# EAGLE design untitled (EAGLE 7.4.0)
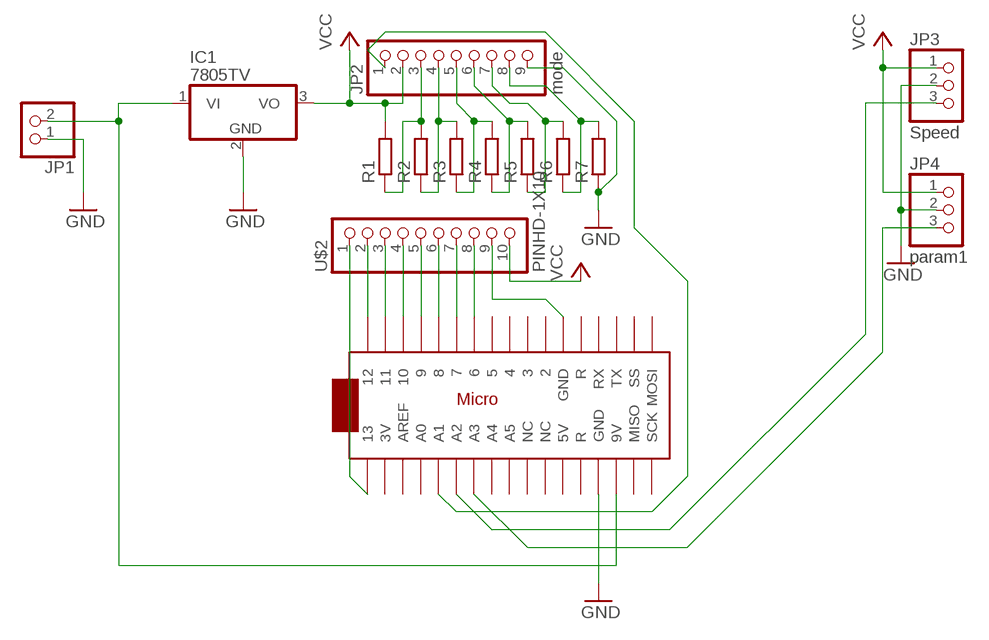
[diagram p0: schematic, sheet 1]

## Parts
IC1  7805TV  [TO220V]
JP1  PINHD-1X2  [1X02]
JP2  mode  PINHD-1X9  [1X09-BIG]
JP3  Speed  PINHD-1X3  [1X03]
JP4  param1  PINHD-1X3  [1X03]
R1  R-EU_0204/7  [0204/7]
R2  R-EU_0204/7  [0204/7]
R3  R-EU_0204/7  [0204/7]
R4  R-EU_0204/7  [0204/7]
R5  R-EU_0204/7  [0204/7]
R6  R-EU_0204/7  [0204/7]
R7  R-EU_0204/7  [0204/7]
U$1  ARDUINOMICRO  [ARDUINOMICRO]
U$2  PINHD-1X10  [1X10-BIG]

## Nets
GND: IC1.2(GND) JP1.1 JP2.9 JP3.2 JP4.2 R7.1 U$1.P$12(GND)
N$1: IC1.1(VI) JP1.2 U$1.P$20(9V)
N$3: JP2.3 R1.1 R2.2
N$4: JP2.4 R2.1 R3.2
N$5: JP2.5 R3.1 R4.2
N$6: JP2.6 R4.1 R5.2
N$7: JP2.7 R5.1 R6.2
N$8: JP2.8 R6.1 R7.2
N$11: JP2.1 U$1.P$30(A1)
N$13: JP3.3 U$1.P$29(A2)
N$14: JP4.3 U$1.P$28(A3)
N$15: U$1.P$34 U$2.1
N$16: U$1.P$1 U$2.2
N$17: U$1.P$2 U$2.3
N$18: U$1.P$3 U$2.4
N$19: U$1.P$4 U$2.5
N$20: U$1.P$5 U$2.6
N$21: U$1.P$6 U$2.7
N$22: U$1.P$7 U$2.8
N$23: U$1.P$21(GND) U$2.9
VCC: IC1.3(VO) JP2.2 JP3.1 JP4.1 R1.2 U$2.10
Unconnected: U$1.P$8 U$1.P$9 U$1.P$10 U$1.P$11 U$1.P$13(R) U$1.P$14(RX) U$1.P$15(TX) U$1.P$16(SS) U$1.P$17(MOSI) U$1.P$18(SCK) U$1.P$19(MISO) U$1.P$22(R) U$1.P$23(5V) U$1.P$24(NC) U$1.P$25(NC) U$1.P$26(A5) U$1.P$27(A4) U$1.P$31(A0) U$1.P$32(AREF) U$1.P$33(3V)

## Library data of the parts
IC1 = linear:78*: Positive VOLTAGE REGULATOR Source: http://cache.national.com/ds/LM/LM78L05.pdf http://www.fairchildsemi.com/ds/LM/LM7805.pdf
JP1 = pinhead:PINHD-1X2: PIN HEADER
JP2 = adafruit:PINHD-1X9: Pin header 1x10 0.1" spacing With round pins
JP3 JP4 = adafruit:PINHD-1X3: PIN HEADER
R1-R7 = rcl:R-EU_: RESISTOR, European symbol
U$1 = adafruit:ARDUINOMICRO
U$2 = adafruit:PINHD-1X10: Pin header 1x10 0.1" spacing With round pins

## Board
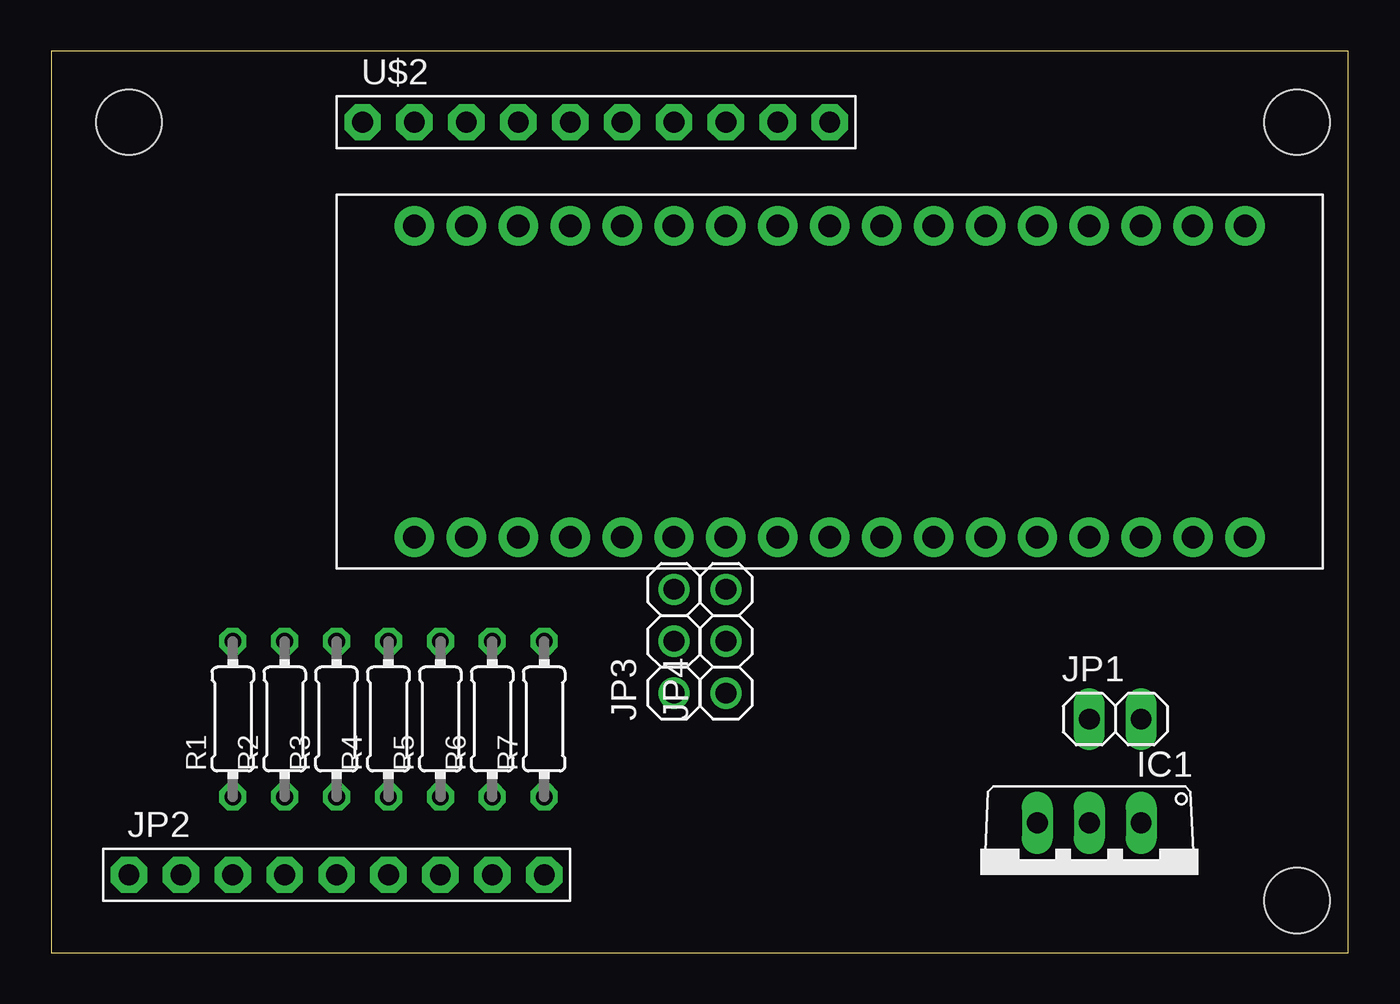
[diagram p1: board, top side]
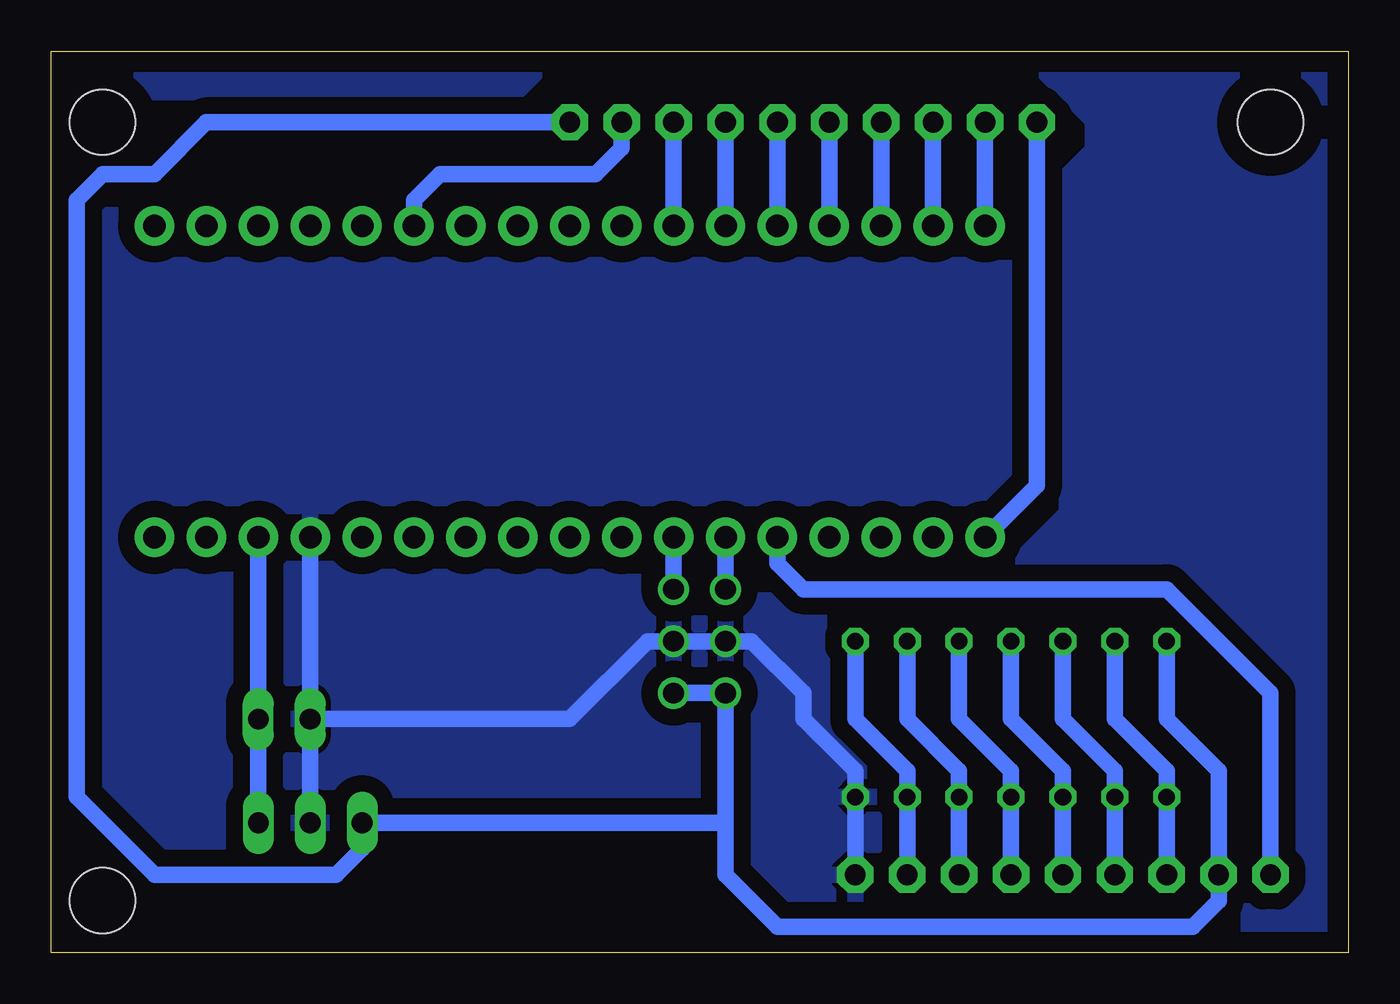
[diagram p2: board, bottom side, seen from below]

Size 63.48 x 44.12 mm. Coordinates in mm from the lower left corner, seen from the top.
Outline: 0,0 63.48,0 63.48,44.12 0,44.12 0,0
Copper layers (1*16): Top 0.035mm / dielectric 1.5mm / Bottom 0.035mm
Design rules "default": minimum track width 10mil, minimum drill 24mil, track to track 8mil, track to pad 8mil, pad to pad 8mil, via to via 8mil, smd to smd 8mil, copper to edge 40mil, drill to drill 8mil, minimum pad ring 10mil, minimum via ring 8mil, stop-mask expansion 4mil, vias tented up to drill 0mil, thermal gap 10mil
Holes 3.2 mm at 3.81,40.64 60.96,2.54 60.96,40.64

### Footprints (pad centres in the part's own frame; a part is rotated, then mirrored left to right if it is on the bottom)
TO220V = drill 1.016 long: 1 -2.54,-2.54; 2 0,-2.54; 3 2.54,-2.54
1X02 = drill 1.016 long: 1 -1.27,0; 2 1.27,0
1X09-BIG = drill 1.016 pad 1.778 octagon: 1 -10.16,0; 2 -7.62,0; 3 -5.08,0; 4 -2.54,0; 5 0,0; 6 2.54,0; 7 5.08,0; 8 7.62,0; 9 10.16,0
1X03 = drill 1.016: 1 -2.54,0; 2 0,0; 3 2.54,0
0204/7 = drill 0.813 octagon: 1 -3.81,0; 2 3.81,0
ARDUINOMICRO = drill 1.1 pad 1.93: P$1 -20.32,7.62; P$2 -17.78,7.62; P$3 -15.24,7.62; P$4 -12.7,7.62; P$5 -10.16,7.62; P$6 -7.62,7.62; P$7 -5.08,7.62; P$8 -2.54,7.62; P$9 0,7.62; P$10 2.54,7.62; P$11 5.08,7.62; P$12 12.7,-7.62; P$13 10.16,-7.62; P$14 12.7,7.62; P$15 15.24,7.62; P$16 17.78,7.62; P$17 20.32,7.62; P$18 20.32,-7.62; P$19 17.78,-7.62; P$20 15.24,-7.62; P$21 7.62,7.62; P$22 10.16,7.62; P$23 7.62,-7.62; P$24 5.08,-7.62; P$25 2.54,-7.62; P$26 0,-7.62; P$27 -2.54,-7.62; P$28 -5.08,-7.62; P$29 -7.62,-7.62; P$30 -10.16,-7.62; P$31 -12.7,-7.62; P$32 -15.24,-7.62; P$33 -17.78,-7.62; P$34 -20.32,-7.62
1X10-BIG = drill 1.016 pad 1.778 octagon: 1 -11.43,0; 2 -8.89,0; 3 -6.35,0; 4 -3.81,0; 5 -1.27,0; 6 1.27,0; 7 3.81,0; 8 6.35,0; 9 8.89,0; 10 11.43,0

### Placement (x,y rotation side)
IC1  50.8,3.81 180 top
JP1  52.07,11.43 0 top
JP2  13.97,3.81 0 top
JP3  30.48,15.24 90 top
JP4  33.02,15.24 90 top
R1  8.89,11.43 90 top
R2  11.43,11.43 90 top
R3  13.97,11.43 90 top
R4  16.51,11.43 90 top
R5  19.05,11.43 90 top
R6  21.59,11.43 90 top
R7  24.13,11.43 90 top
U$1  38.1,27.94 0 top
U$2  26.67,40.64 0 top

### Tracks (layer width: path | path; a pad name or v marks a point on that pad's centre or on a via)
GND
  Bottom 0.813: U$1.P$12 JP1.1 | IC1.2 JP1.1 | JP1.1 38.1,11.43 34.29,15.24 JP4.2 JP3.2 29.21,15.24 26.67,12.7 26.67,11.43 24.13,8.89 R7.1 JP2.9
  pour Bottom (isolate 0.813): 0,44.45 64.77,44.45 64.77,0 0,0
N$1
  Bottom 0.813: U$1.P$20 JP1.2 IC1.1
N$2
  pour Bottom (isolate 0.813): 0,44.45 63.5,44.45 63.5,38.1 59.69,41.91 40.64,41.91 39.37,43.18 15.24,43.18 12.7,40.64 12.7,39.37 13.97,38.1 13.97,21.59 16.51,19.05 8.89,19.05 2.54,12.7 2.54,2.54 5.08,2.54 5.08,0 0,0
N$3
  Bottom 0.813: R2.2 11.43,11.43 8.89,8.89 R1.1 JP2.3
N$4
  Bottom 0.813: R3.2 13.97,11.43 11.43,8.89 R2.1 JP2.4
N$5
  Bottom 0.813: R4.2 16.51,11.43 13.97,8.89 R3.1 JP2.5
N$6
  Bottom 0.813: R5.2 19.05,11.43 16.51,8.89 R4.1 JP2.6
N$7
  Bottom 0.813: R6.2 21.59,11.43 19.05,8.89 R5.1 JP2.7
N$8
  Bottom 0.813: R7.2 24.13,11.43 21.59,8.89 R6.1 JP2.8
N$11
  Bottom 0.813: U$1.P$30 27.94,19.05 26.67,17.78 8.89,17.78 3.81,12.7 JP2.1
N$13
  Bottom 0.813: JP3.3 U$1.P$29
N$14
  Bottom 0.813: U$1.P$28 JP4.3
N$15
  Bottom 0.813: U$2.1 15.24,22.86 U$1.P$34
N$16
  Bottom 0.813: U$2.2 U$1.P$1
N$17
  Bottom 0.813: U$2.3 U$1.P$2
N$18
  Bottom 0.813: U$2.4 U$1.P$3
N$19
  Bottom 0.813: U$2.5 U$1.P$4
N$20
  Bottom 0.813: U$2.6 U$1.P$5
N$21
  Bottom 0.813: U$2.7 U$1.P$6
N$22
  Bottom 0.813: U$2.8 U$1.P$7
N$23
  Bottom 0.813: U$2.9 35.56,39.37 36.83,38.1 44.45,38.1 45.72,36.83 U$1.P$21
VCC
  Bottom 0.813: JP4.1 JP3.1 30.48,6.35 | R1.2 8.89,11.43 6.35,8.89 JP2.2 6.35,2.54 7.62,1.27 27.94,1.27 30.48,3.81 30.48,6.35 | 30.48,6.35 IC1.3 48.26,5.08 49.53,3.81 58.42,3.81 62.23,7.62 62.23,36.83 60.96,38.1 58.42,38.1 55.88,40.64 U$2.10